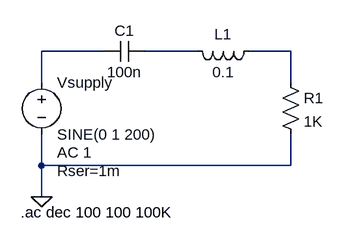
[diagram p0: schematic Aufgabe3d.asc]
Aufgabe3d.asc, the LTspice schematic file:
Version 4
SHEET 1 880 680
WIRE 112 112 16 112
WIRE 256 112 176 112
WIRE 400 112 336 112
WIRE 16 160 16 112
WIRE 400 160 400 112
WIRE 16 288 16 240
WIRE 400 288 400 240
WIRE 400 288 16 288
WIRE 16 336 16 288
FLAG 16 336 0
SYMBOL res 384 144 R0
SYMATTR InstName R1
SYMATTR Value 1K
SYMBOL cap 176 96 R90
WINDOW 0 0 32 VBottom 2
WINDOW 3 32 32 VTop 2
SYMATTR InstName C1
SYMATTR Value 100n
SYMBOL voltage 16 144 R0
WINDOW 123 24 124 Left 2
WINDOW 39 24 152 Left 2
SYMATTR Value2 AC 1
SYMATTR SpiceLine Rser=1m
SYMATTR InstName Vsupply
SYMATTR Value SINE(0 1 200)
SYMBOL ind 352 96 R90
WINDOW 0 5 56 VBottom 2
WINDOW 3 32 56 VTop 2
SYMATTR InstName L1
SYMATTR Value 0.1
TEXT -16 360 Left 2 !.ac dec 100 100 100K

The netlist it stands for:
* Aufgabe3d.asc
R1 N003 0 1K
C1 N002 N001 100n
Vsupply N001 0 SINE(0 1 200) AC 1 Rser=1m
L1 N003 N002 0.1
.ac dec 100 100 100K
.backanno
.end